# EAGLE design LogicPCB (EAGLE 9.4.2)
Assembly variants: basic, pinout, FIX
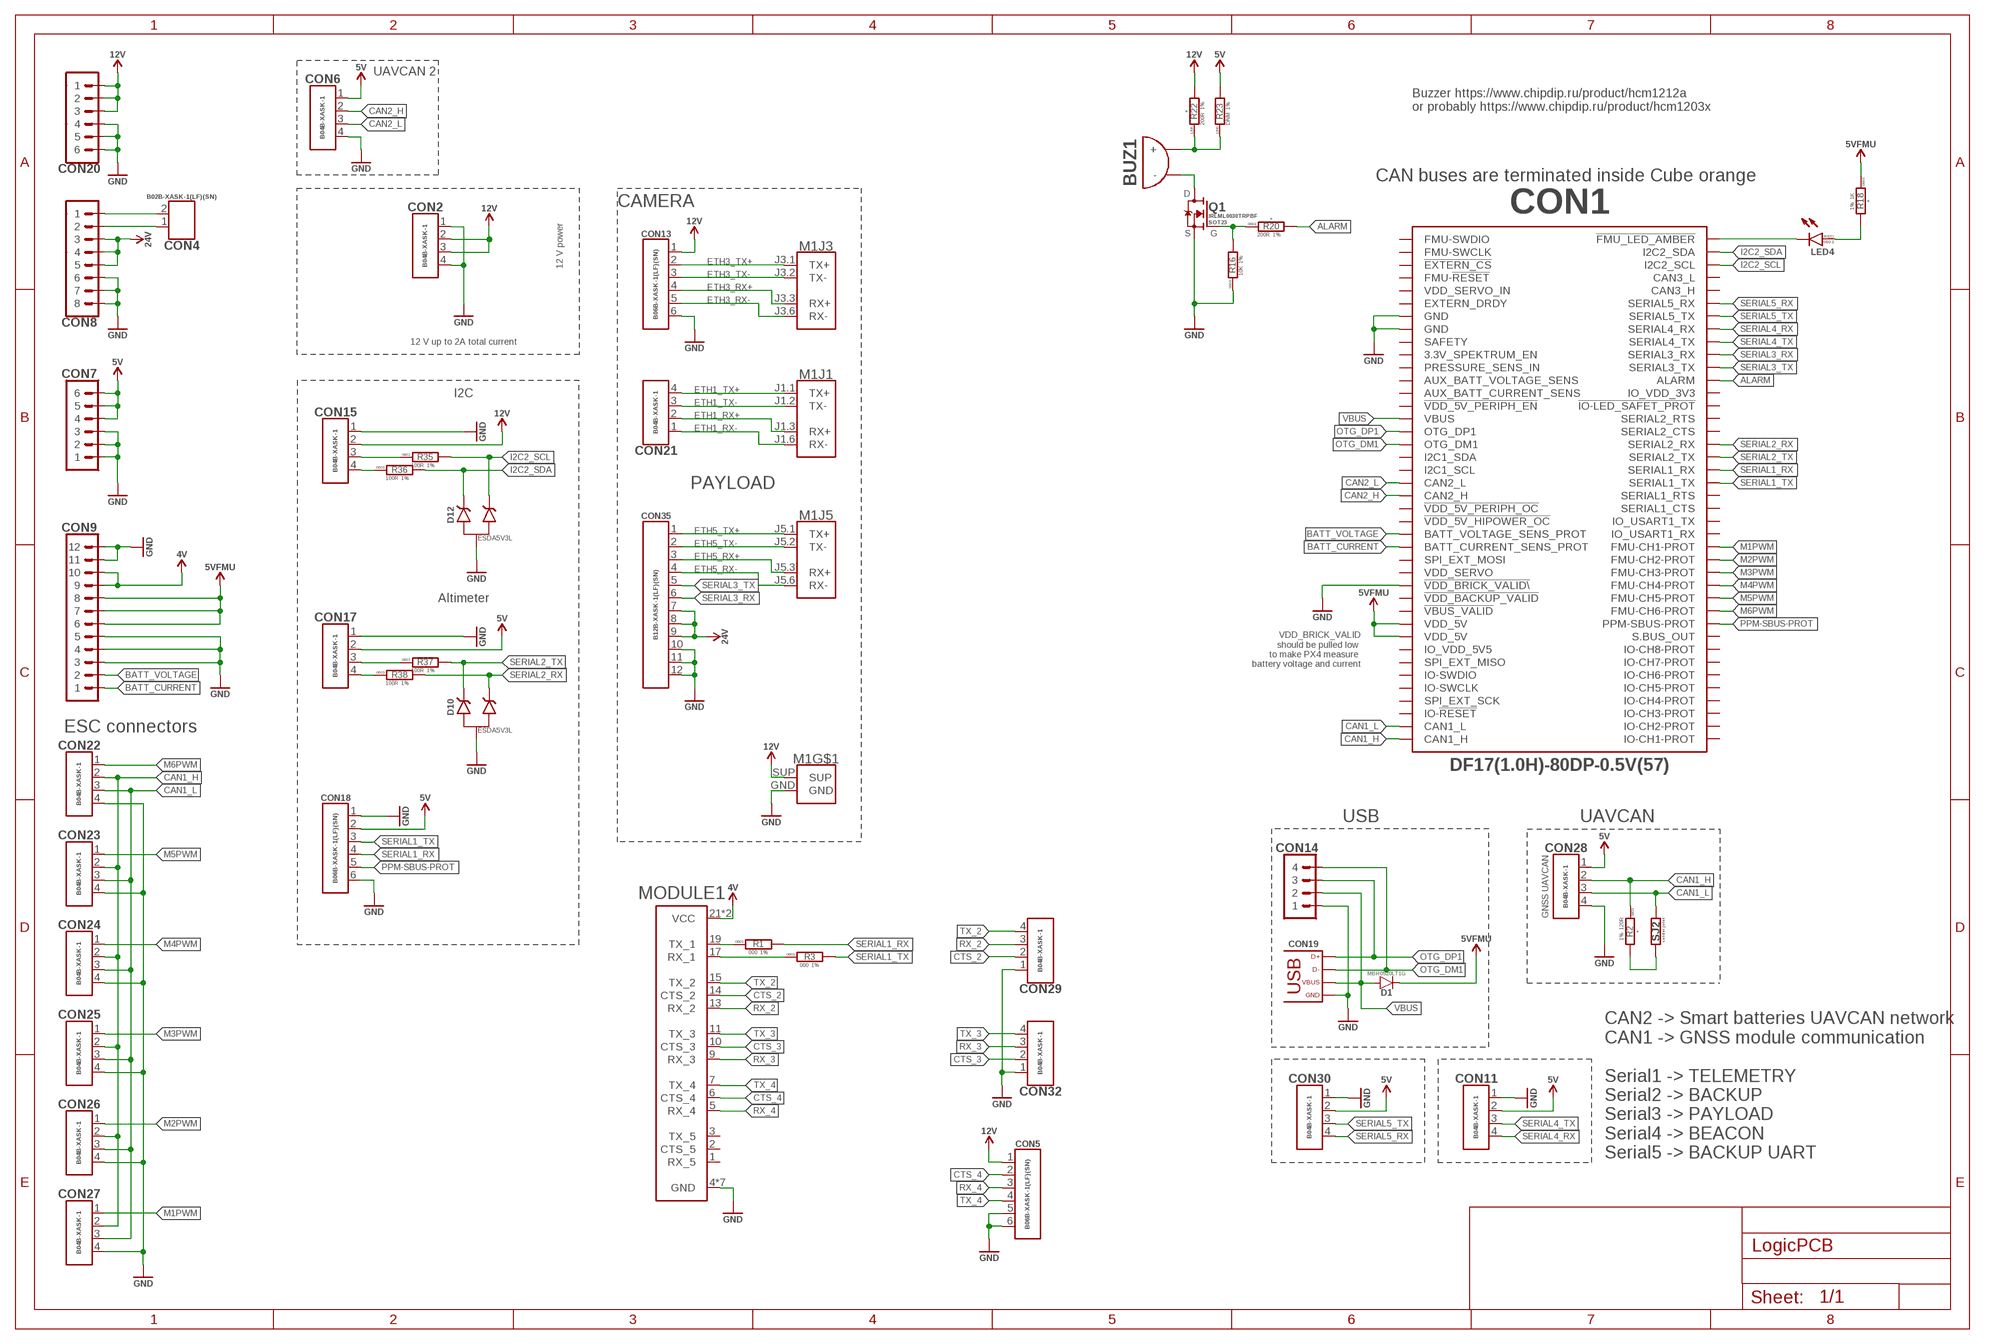
[diagram p0: schematic, sheet 1]

## Parts
BUZ1  BUZZER-ЕР-12MM  [BUZZER_12MM]  (not fitted in variant pinout)
CON1  CUBE_ORANGE_  [CUBE_ORANGE]
CON2  CON-4P-JST-XA  [B04B-XASK-1]
CON4  CON-2P-JST-XA  [B02B-XASK-1]
CON5  CON-6P-JST-XA  [B06B-XASK-1]
CON6  CON-4P-JST-XA  [B04B-XASK-1]
CON7  PINHEAD_1X06-2.54  [1X06-PTH-2.54]
CON8  PINHEAD_1X08-2.54  [1X08-PTH-2.54]
CON9  PINHEAD_1X12-2.54  [1X12-PTH-2.54]
CON11  CON-4P-JST-XA  [B04B-XASK-1]
CON13  CON-6P-JST-XA  [B06B-XASK-1]
CON14  PINHEAD_1X04-2.54  [1X04-PTH-2.54]  (not fitted in variant basic)  (not fitted in variant pinout)
CON15  CON-4P-JST-XA  [B04B-XASK-1]
CON17  CON-4P-JST-XA  [B04B-XASK-1]
CON18  CON-6P-JST-XA  [B06B-XASK-1]
CON19  USB-TYPE-C-VERT-PROD  [2047110001-PROD]
CON20  PINHEAD_1X06-2.54  [1X06-PTH-2.54]
CON21  CON-4P-JST-XA  [B04B-XASK-1]
CON22  CON-4P-JST-XA  [B04B-XASK-1]
CON23  CON-4P-JST-XA  [B04B-XASK-1]
CON24  CON-4P-JST-XA  [B04B-XASK-1]
CON25  CON-4P-JST-XA  [B04B-XASK-1]
CON26  CON-4P-JST-XA  [B04B-XASK-1]
CON27  CON-4P-JST-XA  [B04B-XASK-1]
CON28  CON-4P-JST-XA  [B04B-XASK-1]
CON29  CON-4P-JST-XA  [B04B-XASK-1]
CON30  CON-4P-JST-XA  [B04B-XASK-1]
CON32  CON-4P-JST-XA  [B04B-XASK-1]
CON35  CON-12P-JST-XA  [B12B-XASK-1]
D1  MBR0520L-SOD123  [SOD123]  (not fitted in variant pinout)
D10  ESDA5V3L  [SOT23B-3]
D12  ESDA5V3L  [SOT23B-3]
LED4  LED-0603  [LED0603]  (not fitted in variant pinout)
M1  05G_ETHERNET_SWITCH  [05G_ETH_SWITCH]
MODULE1  MODEM_CARRIER  [MODEM_CARRIER]
Q1  IRLML0030  [SOT23]  (not fitted in variant pinout)
R1  000  R-1%-0603  [R0603]
R2  120R  R-1%-0603  [R0603]  (not fitted in variant pinout)
R3  000  R-1%-0603  [R0603]
R16  10K  R-1%-0603  [R0603]
R18  1K  R-1%-0603  [R0603]  (not fitted in variant pinout)
R20  200R  R-1%-0603  [R0603]  (not fitted in variant pinout)
R22  200R  R-1%-1206  [R1206]  (not fitted in variant pinout)
R23  DNM  R-1%-1206  [R1206]  (not fitted in variant basic)  (not fitted in variant pinout)
R35  100R  R-1%-0603  [R0603]
R36  100R  R-1%-0603  [R0603]
R37  100R  R-1%-0603  [R0603]
R38  100R  R-1%-0603  [R0603]
SJ2  SOLDER_JOINT-SJ1  [RES_0]  (not fitted in variant basic)  (not fitted in variant pinout)

## Nets
5VFMU: CON1.61(VDD_5V) CON1.63(VDD_5V) CON9.6 CON9.7 CON9.8 D1.C R18.1
!FMU_LED_AMBER: CON1.2(!FMU_LED_AMBER) LED4.C
ALARM: CON1.24(ALARM) R20.2
BATT_CURRENT: CON1.49(BATT_CURRENT_SENS_PROT) CON9.1
BATT_VOLTAGE: CON1.47(BATT_VOLTAGE_SENS_PROT) CON9.2
CAN1_H: CON1.79(CAN1_H) CON22.2 CON23.2 CON24.2 CON25.2 CON26.2 CON27.2 CON28.2 R2.1
CAN1_L: CON1.77(CAN1_L) CON22.3 CON23.3 CON24.3 CON25.3 CON26.3 CON27.3 CON28.3 SJ2.2
CAN2_H: CON1.41(CAN2_H) CON6.2
CAN2_L: CON1.39(CAN2_L) CON6.3
CTS_2: CON29.2 MODULE1.14(CTS_2)
CTS_3: CON32.2 MODULE1.10(CTS_3)
CTS_4: CON5.2 MODULE1.6(CTS_4)
ETH1_RX+: CON21.2 M1.J1.3(J1:RX+)
ETH1_RX-: CON21.1 M1.J1.6(J1:RX-)
ETH1_TX+: CON21.4 M1.J1.1(J1:TX+)
ETH1_TX-: CON21.3 M1.J1.2(J1:TX-)
ETH3_RX+: CON13.4 M1.J3.3(J3:RX+)
ETH3_RX-: CON13.5 M1.J3.6(J3:RX-)
ETH3_TX+: CON13.2 M1.J3.1(J3:TX+)
ETH3_TX-: CON13.3 M1.J3.2(J3:TX-)
ETH5_RX+: CON35.3 M1.J5.3(J5:RX+)
ETH5_RX-: CON35.4 M1.J5.6(J5:RX-)
ETH5_TX+: CON35.1 M1.J5.1(J5:TX+)
ETH5_TX-: CON35.2 M1.J5.2(J5:TX-)
GND: CON1.13(GND) CON1.15(GND) CON1.55(!VDD_BRICK_VALID\) CON2.1 CON2.4 CON5.5 CON5.6 CON6.4 CON7.1 CON7.2 CON7.3 CON8.6 CON8.7 CON8.8 CON9.3 CON9.4 CON9.5 CON9.11 CON9.12 CON11.1 CON13.6 CON14.1 CON15.1 CON17.1 CON18.1 CON18.6 CON19.A1(GND) CON19.A12(GND) CON19.B1(GND) CON19.B12(GND) CON19.G1(GND) CON19.G2(GND) CON19.G4(GND) CON19.G5(GND) CON19.G7(GND) CON19.G8(GND) CON19.G9(GND) CON19.G10(GND) CON19.P$1(GND) CON19.P$2(GND) CON20.4 CON20.5 CON20.6 CON22.4 CON23.4 CON24.4 CON25.4 CON26.4 CON27.4 CON28.4 CON29.1 CON30.1 CON32.1 CON35.10 CON35.11 CON35.12 D10.3(A) D12.3(A) M1.GND MODULE1.4(GND) MODULE1.8(GND) MODULE1.12(GND) MODULE1.16(GND) MODULE1.20(GND) MODULE1.22(GND) MODULE1.24(GND) Q1.2(S) R16.1
I2C2_SCL: CON1.6(I2C2_SCL) D12.2(C1) R35.2
I2C2_SDA: CON1.4(I2C2_SDA) D12.1(C) R36.2
M1PWM: CON1.50(FMU-CH1-PROT) CON27.1
M2PWM: CON1.52(FMU-CH2-PROT) CON26.1
M3PWM: CON1.54(FMU-CH3-PROT) CON25.1
M4PWM: CON1.56(FMU-CH4-PROT) CON24.1
M5PWM: CON1.58(FMU-CH5-PROT) CON23.1
M6PWM: CON1.60(FMU-CH6-PROT) CON22.1
N$1: LED4.A R18.2
N$2: CON4.2 CON8.1
N$3: BUZ1.2(-) Q1.3(D)
N$4: MODULE1.19(TX_1) R1.1
N$5: Q1.1(G) R16.2 R20.1
N$6: MODULE1.17(RX_1) R3.1
N$7: CON4.1 CON8.2
N$8: R2.2 SJ2.1
N$13: BUZ1.1(+) R22.P$1 R23.P$1
N$20: CON15.3 R35.1
N$21: CON15.4 R36.1
N$22: CON17.3 R37.1
N$23: CON17.4 R38.1
OTG_DM1: CON1.33(OTG_DM1) CON14.4 CON19.A7(D-) CON19.B7(D-)
OTG_DP1: CON1.31(OTG_DP1) CON14.3 CON19.A6(D+) CON19.B6(D+)
PPM-SBUS-PROT: CON1.62(PPM-SBUS-PROT) CON18.5
RX_2: CON29.3 MODULE1.13(RX_2)
RX_3: CON32.3 MODULE1.9(RX_3)
RX_4: CON5.3 MODULE1.5(RX_4)
SERIAL1_RX: CON1.38(SERIAL1_RX) CON18.4 R1.2
SERIAL1_TX: CON1.40(SERIAL1_TX) CON18.3 R3.2
SERIAL2_RX: CON1.34(SERIAL2_RX) D10.2(C1) R38.2
SERIAL2_TX: CON1.36(SERIAL2_TX) D10.1(C) R37.2
SERIAL3_RX: CON1.20(SERIAL3_RX) CON35.6
SERIAL3_TX: CON1.22(SERIAL3_TX) CON35.5
SERIAL4_RX: CON1.16(SERIAL4_RX) CON11.4
SERIAL4_TX: CON1.18(SERIAL4_TX) CON11.3
SERIAL5_RX: CON1.12(SERIAL5_RX) CON30.4
SERIAL5_TX: CON1.14(SERIAL5_TX) CON30.3
TX_2: CON29.4 MODULE1.15(TX_2)
TX_3: CON32.4 MODULE1.11(TX_3)
TX_4: CON5.4 MODULE1.7(TX_4)
VBUS: CON1.29(VBUS) CON14.2 CON19.A4(VBUS) CON19.B4(VBUS) D1.A
VDD_4V: CON9.9 CON9.10 MODULE1.21(VCC) MODULE1.23(VCC) ; supply symbol labelled 4V
VDD_5V: CON6.1 CON7.4 CON7.5 CON7.6 CON11.2 CON17.2 CON18.2 CON28.1 CON30.2 R23.P$2 ; supply symbol labelled 5V
VDD_12V: CON2.2 CON2.3 CON5.1 CON13.1 CON15.2 CON20.1 CON20.2 CON20.3 M1.SUP R22.P$2 ; supply symbol labelled 12V
VDD_24V: CON8.3 CON8.4 CON8.5 CON35.7 CON35.8 CON35.9 ; supply symbol labelled 24V
Unconnected: CON1.1(FMU-SWDIO) CON1.3(FMU-SWCLK) CON1.5(!EXTERN_CS) CON1.7(FMU-!RESET) CON1.8(CAN3_L) CON1.9(VDD_SERVO_IN) CON1.10(CAN3_H) CON1.11(EXTERN_DRDY) CON1.17(SAFETY) CON1.19(3.3V_SPEKTRUM_EN) CON1.21(PRESSURE_SENS_IN) CON1.23(AUX_BATT_VOLTAGE_SENS) CON1.25(AUX_BATT_CURRENT_SENS) CON1.26(IO_VDD_3V3) CON1.27(!VDD_5V_PERIPH_EN) CON1.28(!IO-LED_SAFET_PROT) CON1.30(SERIAL2_RTS) CON1.32(SERIAL2_CTS) CON1.35(I2C1_SDA) CON1.37(I2C1_SCL) CON1.42(SERIAL1_RTS) CON1.43(!VDD_5V_PERIPH_OC) CON1.44(SERIAL1_CTS) CON1.45(!VDD_5V_HIPOWER_OC) CON1.46(IO_USART1_TX) CON1.48(IO_USART1_RX) CON1.51(SPI_EXT_MOSI) CON1.53(VDD_SERVO) CON1.57(!VDD_BACKUP_VALID) CON1.59(!VBUS_VALID) CON1.64(S.BUS_OUT) CON1.65(IO_VDD_5V5) CON1.66(IO-CH8-PROT) CON1.67(SPI_EXT_MISO) CON1.68(IO-CH7-PROT) CON1.69(IO-SWDIO) CON1.70(IO-CH6-PROT) CON1.71(IO-SWCLK) CON1.72(IO-CH5-PROT) CON1.73(SPI_EXT_SCK) CON1.74(IO-CH4-PROT) CON1.75(IO-!RESET) CON1.76(IO-CH3-PROT) CON1.78(IO-CH2-PROT) CON1.80(IO-CH1-PROT) M1.J2.1(J2:TX+) M1.J2.2(J2:TX-) M1.J2.3(J2:RX+) M1.J2.6(J2:RX-) M1.J4.1(J4:TX+) M1.J4.2(J4:TX-) M1.J4.3(J4:RX+) M1.J4.6(J4:RX-) MODULE1.1(RX_5) MODULE1.2(CTS_5) MODULE1.3(TX_5)

## Notes on the sheet
- UAVCAN 2
- Buzzer https://www.chipdip.ru/product/hcm1212a
  or probably https://www.chipdip.ru/product/hcm1203x
- CAN buses are terminated inside Cube orange
- CAMERA
- 12 V power
- 12 V up to 2A total current
- I2C
- PAYLOAD
- Altimeter
- VDD_BRICK_VALID
  should be pulled low 
  to make PX4 measure 
  battery voltage and current
- ESC connectors
- USB | UAVCAN
- GNSS UAVCAN
- CAN2 -> Smart batteries UAVCAN network
  CAN1 -> GNSS module communication
  
  Serial1 -> TELEMETRY
  Serial2 -> BACKUP 
  Serial3 -> PAYLOAD
  Serial4 -> BEACON
  Serial5 -> BACKUP UART

## Library data of the parts
BUZ1 = misc:BUZZER; MANF: JL World; MANF#: HCM1212A
CON1 = misc:CUBE_ORANGE; MANF: HIROSE; MANF#: DF17(1.0H)-80DP-0.5V(57)
CON2 CON6 CON11 CON15 CON17 CON21-CON30 CON32 = Connectors:CON-4P; LCSC#: C264994; MANF: JST Sales America; MANF#: B04B-XASK-1
CON4 = Connectors:CON-2P: Connector 2 position; LCSC#: C263753; MANF: JST Sales America; MANF#: B02B-XASK-1(LF)(SN)
CON5 CON13 CON18 = Connectors:CON-6P: Connector Header 6 position; LCSC#: C264995; MANF: JST Sales America; MANF#: B06B-XASK-1(LF)(SN)
CON7 CON20 = pinhead:PINHEAD_1X06: pinheader 6P
CON8 = pinhead:PINHEAD_1X08: pinheader 8P
CON9 = pinhead:PINHEAD_1X12
CON14 = pinhead:PINHEAD_1X04
CON19 = Connectors:USB: Connector Receptacle USB 2; LCSC#: C381139; MANF: Molex; MANF#: 2047110001
CON35 = Connectors:CON-12P; LCSC#: C160310; MANF: JST Sales America; MANF#: B12B-XASK-1(LF)(SN)
D1 = Diodes:MBR0520L: DIODE SCHOTTKY 20V 500MA SOD123; DIGIKEY#: MBR0520LT1GOSTR-ND; LCSC#: C23848; MANF: ON Semiconductor; MANF#: MBR0520LT1G
D10 D12 = TVS_diodes:ESDA5V3L: TVS DIODE 5.25VWM SOT23; DIGIKEY#: 497-2930-2-ND; LCSC#: C87911; MANF: STMicroelectronics; MANF#: ESDA5V3L
LED4 = rc:LED: Light emitting diode; COLOR: RED; LCSC#: C2286; MANF: Hubei KENTO Elec; MANF#: KT-0603R; PACKAGE: 0603
M1 = ali_modules:05G_ETHERNET_SWITCH
MODULE1 = Pegas_misc:MODEM_CARRIER
Q1 = mosfet:IRLML0030: MOSFET N-CH 30V 5.3A SOT-23-3; DIGIKEY#: IRLML0030TRPBFTR-ND; LCSC#: C3647050; MANF: Infineon Technologies; MANF#: IRLML0030TRPBF; PACKAGE: SOT23
R1 R3 R16 R35-R38 = rc:R; PACKAGE: 0603; TOLERANCE: 1%
R2 = rc:R; ALLOCATED: +; LCSC#: C22787; MANF: UNI-ROYAL(Uniroyal Elec); MANF#: 0603WAF1200T5E; PACKAGE: 0603; TOLERANCE: 1%
R18 R20 = rc:R; ALLOCATED: +; LCSC#: C21190; MANF: UNI-ROYAL(Uniroyal Elec); MANF#: 0603WAF1001T5E; PACKAGE: 0603; TOLERANCE: 1%
R22 = rc:R; ALLOCATED: +; LCSC#: C25361; MANF: UNI-ROYAL; MANF#: 1206W4J0201T5E; PACKAGE: 1206; TOLERANCE: 1%
R23 = rc:R; PACKAGE: 1206; TOLERANCE: 1%
SJ2 = misc:SOLDER_JOINT

## Net classes
1 HV: clearance 0.3 mm to class 0, clearance 0.3 mm

## Board
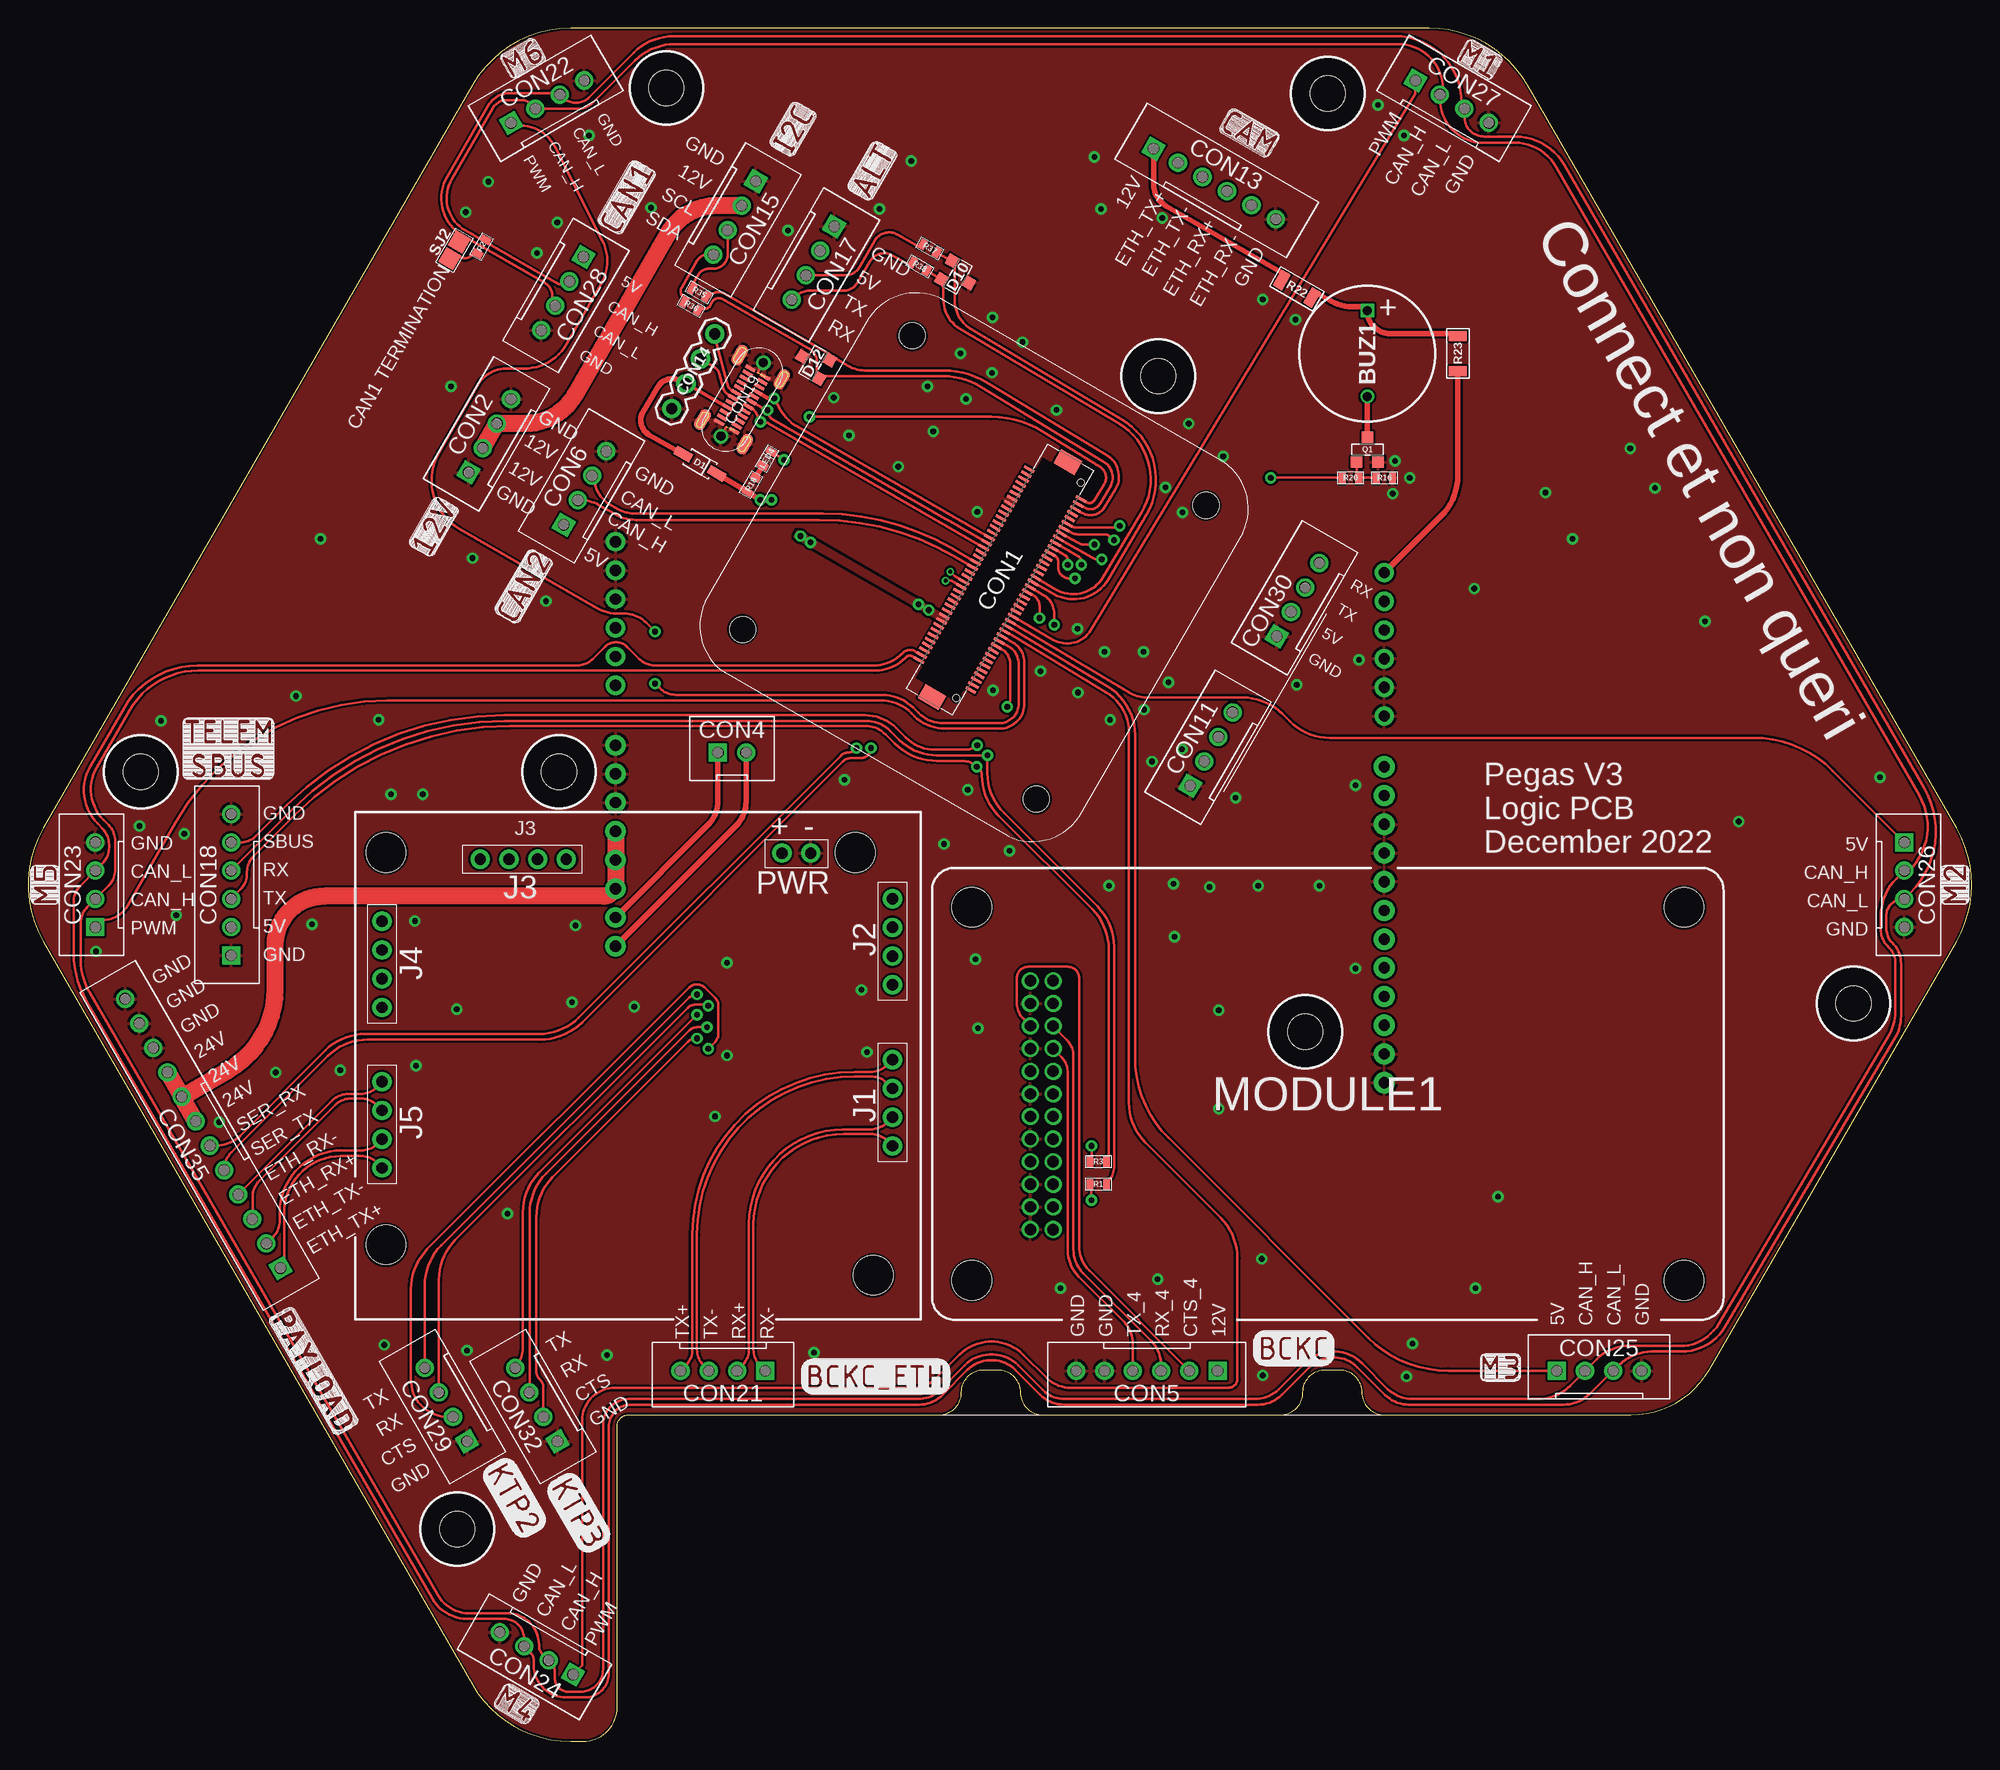
[diagram p1: board, top side]
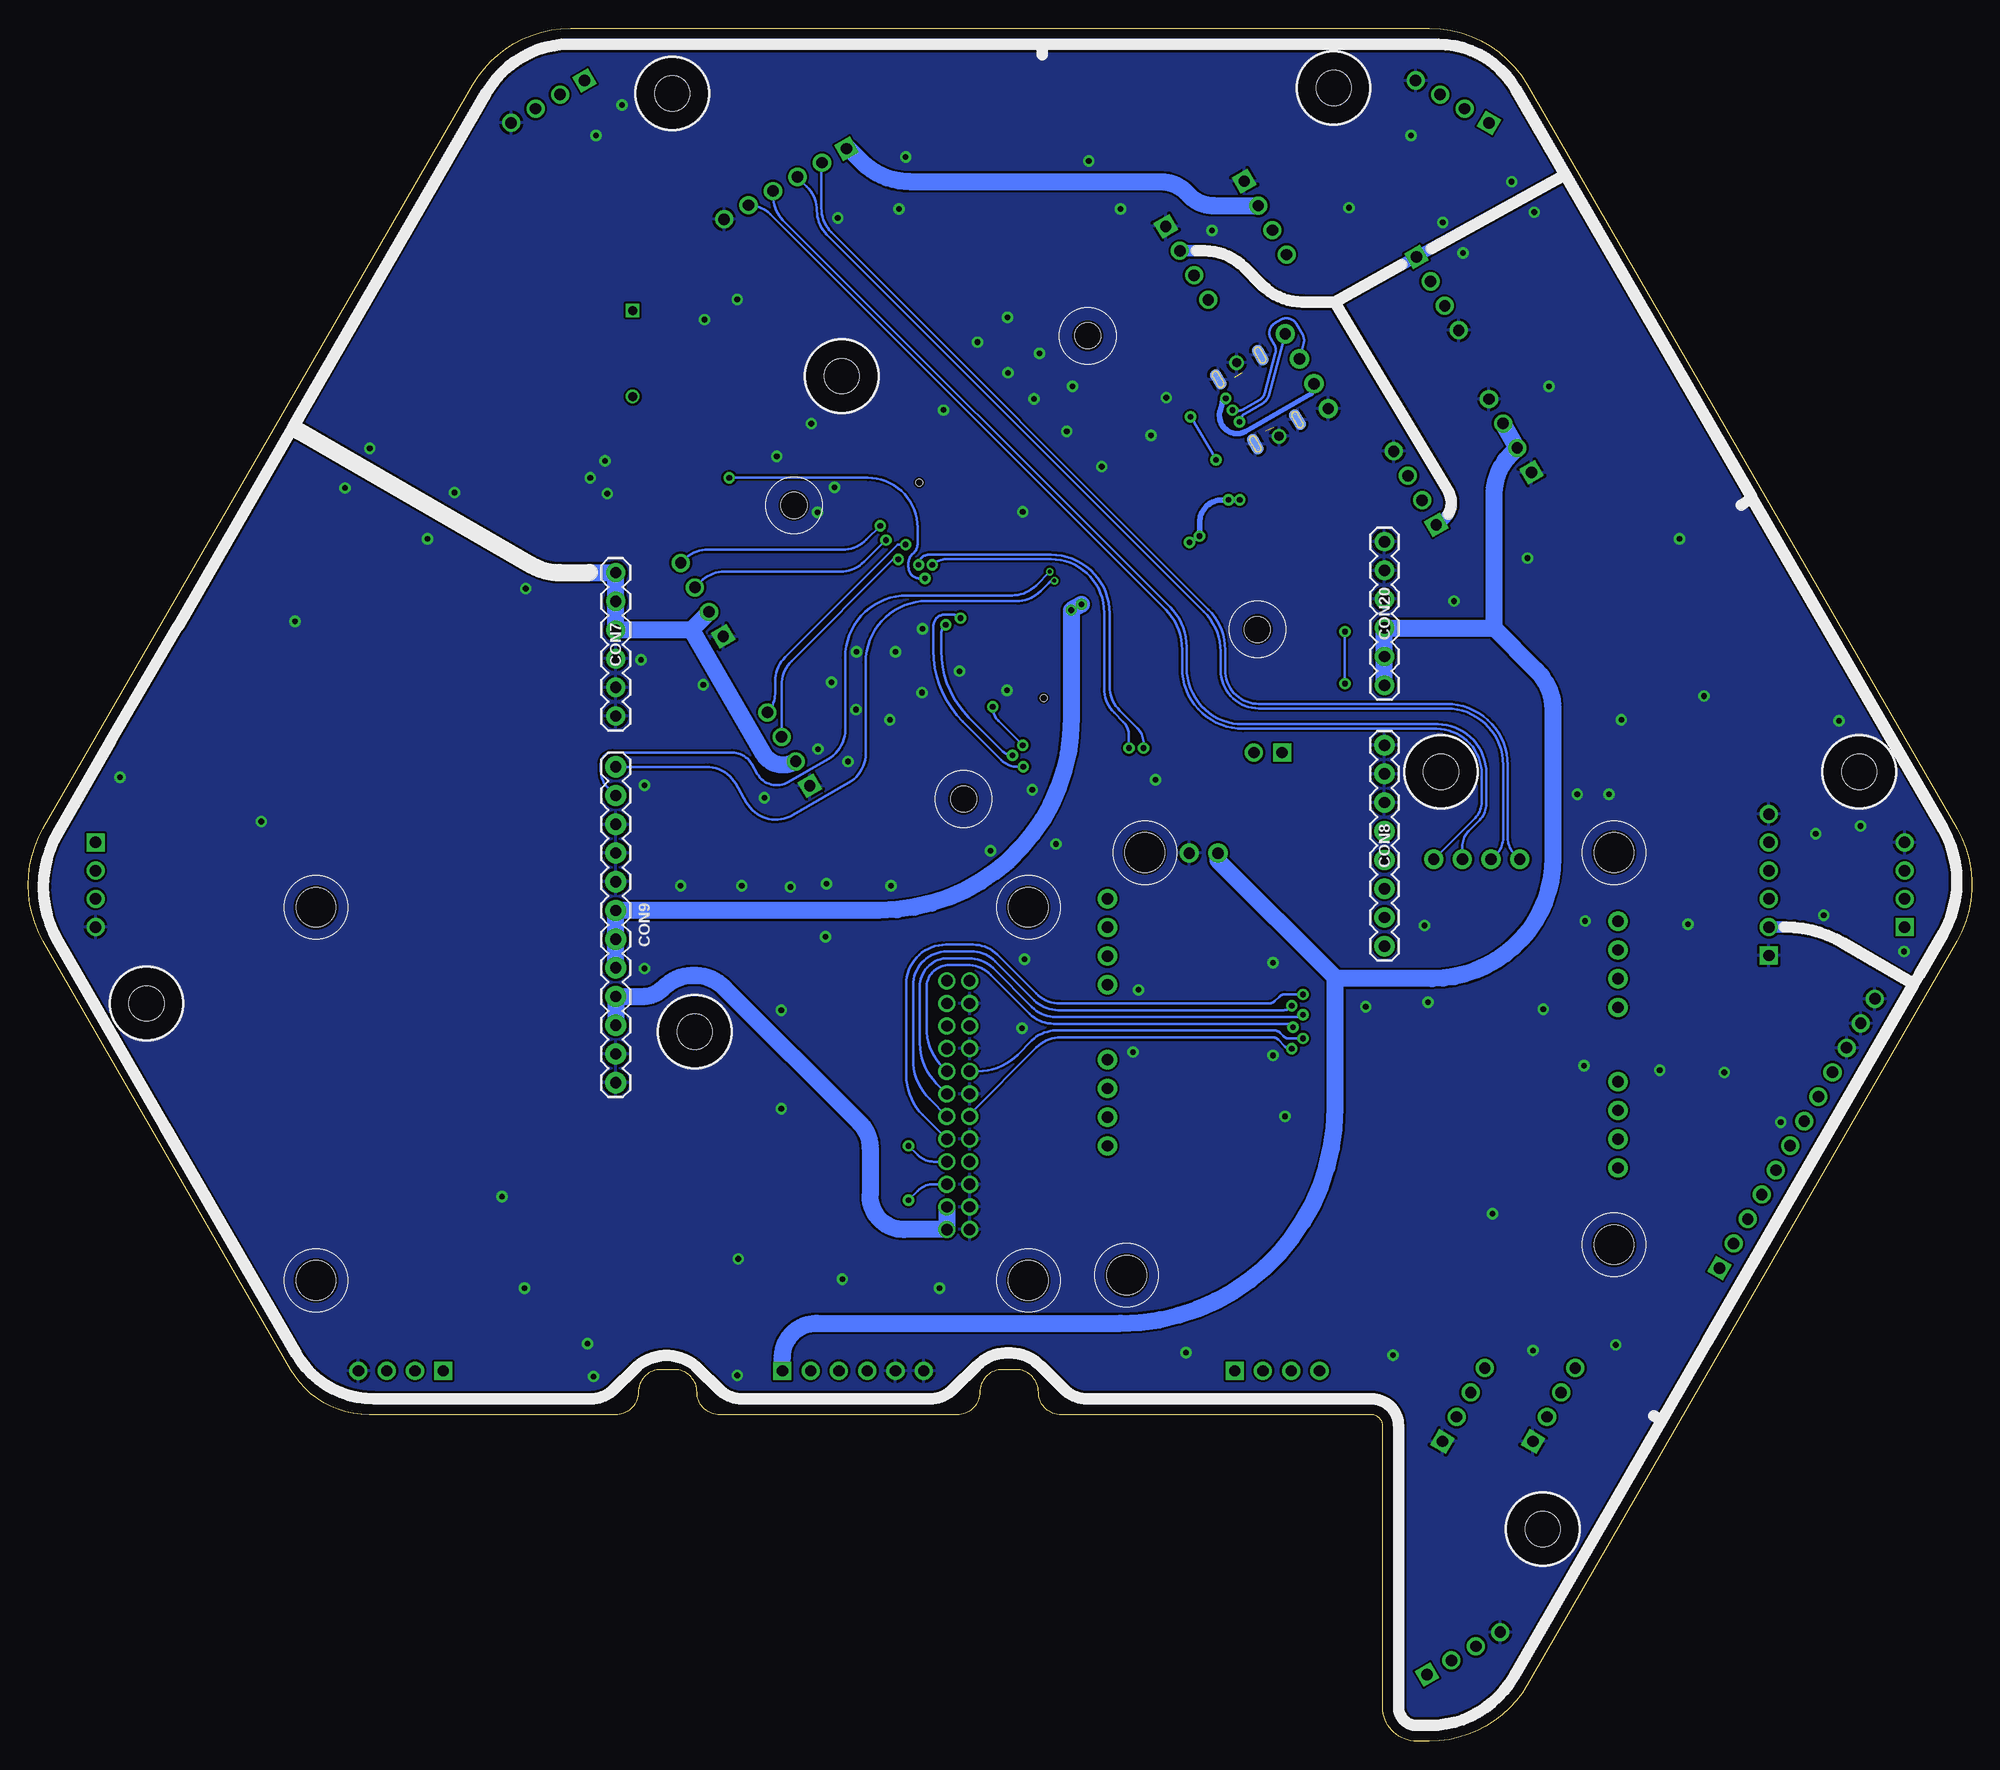
[diagram p2: board, bottom side, seen from below]

Size 171.89 x 151.55 mm. Coordinates in mm from the lower left corner, seen from the top.
Outline: 47.97,0 49.09,0 arc90 52.09,3 52.09,27.88 arc-90 53.09,28.88 80.54,28.88 arc90 82.54,30.88 arc-90 84.54,32.88 85.74,32.88 arc-90 87.74,30.88 arc90 89.74,28.88 110.74,28.88 arc90 112.74,30.88 arc-90 114.74,32.88 115.94,32.88 arc-90 117.94,30.88 arc90 119.94,28.88 141.75,28.88 arc60 148.68,32.88 170.55,70.78 arc60 170.55,80.78 132.58,146.55 arc60 123.92,151.55 47.97,151.55 arc60 39.3,146.55 1.33,80.78 arc60 1.33,70.78 39.3,5 arc60 47.97,0
Copper layers (1*16): Top 0.035mm / dielectric 1.5mm / Bottom 0.035mm
Design rules "JLCPCB 2 layer *": minimum track width 6mil, minimum drill 0.3mm, track to track 0.2mm, track to pad 0.2mm, pad to pad 0.2mm, via to via 0.2mm, smd to smd 0.1mm, copper to edge 0.2mm, drill to drill 6mil, minimum pad ring 0.15mm, minimum via ring 0.15mm, stop-mask expansion 0.05mm, vias tented up to drill 0.5mm, thermal gap 10mil
Holes 3.1 mm at 9.94,85.78 37.94,18.78 114.94,145.78 161.44,65.28 56.44,146.28 99.94,120.78 46.94,85.78 112.94,62.78
Holes 3.5 mm at 31.64,43.93 73.14,78.63 31.64,78.63 83.44,73.78 146.44,73.78 146.44,40.78 83.44,40.78 74.74,41.23
tRestrict: area 6.7,82.5 to 13.2,89; area 34.7,15.5 to 41.2,22; area 111.7,142.5 to 118.2,149; area 158.2,62 to 164.7,68.5; area 53.2,143 to 59.7,149.5; area 96.7,117.5 to 103.2,124; area 43.7,82.5 to 50.2,89; area 109.7,59.5 to 116.2,66
bRestrict: area 6.7,82.5 to 13.2,89; area 34.7,15.5 to 41.2,22; area 111.7,142.5 to 118.2,149; area 158.2,62 to 164.7,68.5; area 53.2,143 to 59.7,149.5; area 96.7,117.5 to 103.2,124; area 43.7,82.5 to 50.2,89; area 109.7,59.5 to 116.2,66

### Footprints (pad centres in the part's own frame; a part is rotated, then mirrored left to right if it is on the bottom)
BUZZER_12MM = drill 0.8 pad 1.2 square: 1 -3.8,0 | drill 0.8 pad 1.2: 2 3.8,0
CUBE_ORANGE = smd 0.25 x 1: 1 9.75,2.65; 2 9.75,-2.65; 3 9.25,2.65; 4 9.25,-2.65; 5 8.75,2.65; 6 8.75,-2.65; 7 8.25,2.65; 8 8.25,-2.65; 9 7.75,2.65; 10 7.75,-2.65; 11 7.25,2.65; 12 7.25,-2.65; 13 6.75,2.65; 14 6.75,-2.65; 15 6.25,2.65; 16 6.25,-2.65; 17 5.75,2.65; 18 5.75,-2.65; 19 5.25,2.65; 20 5.25,-2.65; 21 4.75,2.65; 22 4.75,-2.65; 23 4.25,2.65; 24 4.25,-2.65; 25 3.75,2.65; 26 3.75,-2.65; 27 3.25,2.65; 28 3.25,-2.65; 29 2.75,2.65; 30 2.75,-2.65; 31 2.25,2.65; 32 2.25,-2.65; 33 1.75,2.65; 34 1.75,-2.65; 35 1.25,2.65; 36 1.25,-2.65; 37 0.75,2.65; 38 0.75,-2.65; 39 0.25,2.65; 40 0.25,-2.65; 41 -0.25,2.65; 42 -0.25,-2.65; 43 -0.75,2.65; 44 -0.75,-2.65; 45 -1.25,2.65; 46 -1.25,-2.65; 47 -1.75,2.65; 48 -1.75,-2.65; 49 -2.25,2.65; 50 -2.25,-2.65; 51 -2.75,2.65; 52 -2.75,-2.65; 53 -3.25,2.65; 54 -3.25,-2.65; 55 -3.75,2.65; 56 -3.75,-2.65; 57 -4.25,2.65; 58 -4.25,-2.65; 59 -4.75,2.65; 60 -4.75,-2.65; 61 -5.25,2.65; 62 -5.25,-2.65; 63 -5.75,2.65; 64 -5.75,-2.65; 65 -6.25,2.65; 66 -6.25,-2.65; 67 -6.75,2.65; 68 -6.75,-2.65; 69 -7.25,2.65; 70 -7.25,-2.65; 71 -7.75,2.65; 72 -7.75,-2.65; 73 -8.25,2.65; 74 -8.25,-2.65; 75 -8.75,2.65; 76 -8.75,-2.65; 77 -9.25,2.65; 78 -9.25,-2.65; 79 -9.75,2.65; 80 -9.75,-2.65 | smd 1.4 x 2.1: P1 -12,0; P2 12,0 | hole 0.6: -11,-1.9; 11,-1.9 | hole 2.3: -15.2,17.5; 14.8,17.5; 14.8,-12.5; -15.2,-12.5
B04B-XASK-1 = drill 1 pad 1.6 square: 1 -3.75,0 | drill 1 pad 1.6: 2 -1.25,0; 3 1.25,0; 4 3.75,0
B02B-XASK-1 = drill 1 pad 1.6 square: 1 -1.25,0 | drill 1 pad 1.6: 2 1.25,0
B06B-XASK-1 = drill 1 pad 1.6 square: 1 -6.25,0 | drill 1 pad 1.6: 2 -3.75,0; 3 -1.25,0; 4 1.25,0; 5 3.75,0; 6 6.25,0
1X06-PTH-2.54 = drill 1 pad 1.7: 1 -6.35,0; 2 -3.81,0; 3 -1.27,0; 4 1.27,0; 5 3.81,0; 6 6.35,0
1X08-PTH-2.54 = drill 1 pad 1.8: 1 -8.89,0; 2 -6.35,0; 3 -3.81,0; 4 -1.27,0; 5 1.27,0; 6 3.81,0; 7 6.35,0; 8 8.89,0
1X12-PTH-2.54 = drill 1 pad 1.88: 1 -13.97,0; 2 -11.43,0; 3 -8.89,0; 4 -6.35,0; 5 -3.81,0; 6 -1.27,0; 7 1.27,0; 8 3.81,0; 9 6.35,0; 10 8.89,0; 11 11.43,0; 12 13.97,0
1X04-PTH-2.54 = drill 1 pad 1.7: 1 -3.81,0; 2 -1.27,0; 3 1.27,0; 4 3.81,0
2047110001-PROD = smd 0.3 x 0.95: A1 -2.75,0.755; A2 -2.25,0.755; A3 -1.75,0.755; A4 -1.25,0.755; A5 -0.75,0.755; A6 -0.25,0.755; A7 0.25,0.755; A8 0.75,0.755; A9 1.25,0.755; A10 1.75,0.755; A11 2.25,0.755; A12 2.75,0.755; B1 2.75,-0.755; B2 2.25,-0.755; B3 1.75,-0.755; B4 1.25,-0.755; B5 0.75,-0.755; B6 0.25,-0.755; B7 -0.25,-0.755; B8 -0.75,-0.755; B9 -1.25,-0.755; B10 -1.75,-0.755; B11 -2.25,-0.755; B12 -2.75,-0.755 | smd 1.9 x 1: G1 -3.3,2.15; G4 3.3,2.15; G7 -3.3,-2.15; G9 3.3,-2.15 | smd 1.9 x 1 bottom: G2 -3.3,2.15; G5 3.3,2.15; G8 -3.3,-2.15; G10 3.3,-2.15 | drill 0.8 pad 1.3: P$1 -3.75,0; P$2 3.75,0
B12B-XASK-1 = drill 1 pad 1.6 square: 1 -13.75,0 | drill 1 pad 1.6: 2 -11.25,0; 3 -8.75,0; 4 -6.25,0; 5 -3.75,0; 6 -1.25,0; 7 1.25,0; 8 3.75,0; 9 6.25,0; 10 8.75,0; 11 11.25,0; 12 13.75,0
SOD123 = smd 1.6 x 0.8: A -1.7,0; C 1.7,0
SOT23B-3 = smd 1 x 1: 1 -0.95,-1.1; 2 0.95,-1.1; 3 0,1.1
LED0603 = smd 0.6 x 0.9: A 0.725,0; C -0.725,0
05G_ETH_SWITCH = drill 1 pad 1.7: GND -15.27,-18.8; J1.1 -22.5,-0.52; J1.2 -22.5,2.02; J1.3 -22.5,4.56; J1.6 -22.5,7.1; J2.1 -22.5,-14.77; J2.2 -22.5,-12.23; J2.3 -22.5,-9.69; J2.6 -22.5,-7.15; J3.1 13.97,-18.25; J3.2 11.43,-18.25; J3.3 8.89,-18.25; J3.6 6.35,-18.25; J4.1 22.65,-5.15; J4.2 22.65,-7.69; J4.3 22.65,-10.23; J4.6 22.65,-12.77; J5.1 22.65,9.05; J5.2 22.65,6.51; J5.3 22.65,3.97; J5.6 22.65,1.43; SUP -12.73,-18.8
MODEM_CARRIER = drill 1: 1 -24.3,10; 2 -26.3,10; 3 -24.3,8; 4 -26.3,8; 5 -24.3,6; 6 -26.3,6; 7 -24.3,4; 8 -26.3,4; 9 -24.3,2; 10 -26.3,2; 11 -24.3,0; 12 -26.3,0; 13 -24.3,-2; 14 -26.3,-2; 15 -24.3,-4; 16 -26.3,-4; 17 -24.3,-6; 18 -26.3,-6; 19 -24.3,-8; 20 -26.3,-8; 21 -24.3,-10; 22 -26.3,-10; 23 -24.3,-12; 24 -26.3,-12
SOT23 = smd 1 x 1: 1 1.1,-0.95; 2 1.1,0.95; 3 -1.1,0
R0603 = smd 0.6 x 0.9: 1 -0.725,0; 2 0.725,0
R1206 = smd 0.9 x 1.6: P$1 -1.55,0; P$2 1.55,0
RES_0 = smd 1.5 x 1.5: 1 -0.85,0; 2 0.85,0

### Placement (x,y rotation side)
BUZ1  118.44,122.78 270 top
CON1  85.94,102.78 60 top
CON2  40.83,115.5 60 top
CON4  62.24,87.48 0 top
CON5  98.94,32.78 180 top
CON6  49.24,110.88 60 top
CON7  119.94,97.05 90 bottom
CON8  51.94,79.24 90 bottom
CON9  119.94,72.24 270 bottom
CON11  104.64,87.78 60 top
CON13  104.94,137.78 330 top
CON14  58.82,121.2 60 top
CON15  62.48,134.78 240 top
CON17  69.41,130.78 240 top
CON18  17.94,75.78 90 top
CON19  63.15,118.7 60 top
CON20  51.94,99.78 90 bottom
CON21  61.44,32.78 180 top
CON22  45.94,145.06 30 top
CON23  5.94,75.78 90 top
CON24  44.94,7.78 150 top
CON25  138.94,32.78 0 top
CON26  165.94,75.78 270 top
CON27  125.94,145.06 330 top
CON28  47.24,128.08 240 top
CON29  36.94,29.78 120 top
CON30  112.31,101 60 top
CON32  44.94,29.78 120 top
CON35  15.44,53.78 120 top
D1  59.41,113.02 330 top
D10  82.22,129.59 240 top
D12  69.44,121.95 60 top
LED4  65.34,113.48 240 top
M1  53.94,59.78 180 top
MODULE1  114.94,57.28 0 top
Q1  118.44,114.28 270 top
R1  94.64,49.28 0 top
R2  40.09,132.23 240 top
R3  94.64,51.28 0 top
R16  119.94,111.78 180 top
R18  63.94,111.18 60 top
R20  116.94,111.78 180 top
R22  112.21,128.5 150 top
R23  126.44,122.78 270 top
R35  59.34,128.18 330 top
R36  58.64,126.98 330 top
R37  79.74,132.08 330 top
R38  78.84,130.48 330 top
SJ2  37.7,131.91 60 top

### Tracks (layer width: path | path; a pad name or v marks a point on that pad's centre or on a via)
5VFMU  (via drill 0.5 pad 1)
  Top 0.5: D1.C R18.1 v64.74,109.83 v65.74,109.83
  Bottom 0.5: v69.19,106.08 v68.29,106.63 68.29,107.83 arc90 66.29,109.83 v64.74,109.83
  Bottom 1.5: v78.74,100.58 v79.64,100.08 79.64,90.51 arc90 96.64,73.51 CON9.6 CON9.7 CON9.8
  pour Top (no thermals): 81.1,98.91 67.78,106.6 68.06,107.08 81.38,99.39
!FMU_LED_AMBER  (via drill 0.5 pad 1)
  Top 0.2: v69.09,117.18 85.16,117.18 arc-32 89.74,115.88 94.78,112.78 arc-90 95.16,111.22 94.29,109.78 arc-88 93.63,109.61 CON1.2 | LED4.C v66.84,113.38
  Bottom 0.2: v66.84,113.38 v69.09,117.18
ALARM  (via drill 0.5 pad 1)
  Top 0.2: CON1.24 90.38,105.13 90.85,104.85 arc-59 91.09,104.42 91.09,103.88 arc90 92.09,102.88 v92.59,102.88 | R20.2 v109.89,111.78
  Bottom 0.2: v92.59,102.88 93.04,102.88 arc90 94.04,103.88 94.04,104.26 arc45 93.75,104.97 93.53,105.18 arc-45 93.24,105.89 93.24,107.38 arc-90 97.64,111.78 v109.89,111.78
BATT_CURRENT  (via drill 0.35)
  Top 0.2: CON1.49 81.64,102.68 v81.14,102.68
  Bottom 0.2: v81.14,102.68 arc-45 81.65,102.47 82.36,101.76 arc45 84.48,100.88 92.42,100.88 arc-90 97.82,95.48 97.82,87.4 arc60 99.32,84.8 104.27,81.95 arc90 108.37,83.04 109.33,84.71 arc-60 111.93,86.21 CON9.1
BATT_VOLTAGE  (via drill 0.35)
  Top 0.2: CON1.47 81.94,103.08 v81.54,103.48
  Bottom 0.2: v81.54,103.48 82.76,102.26 arc45 84.88,101.38 94.14,101.38 arc-90 99.64,95.88 99.64,89.49 arc60 101.14,86.9 104.68,84.85 arc90 107.41,85.59 107.92,86.48 arc-60 109.66,87.48 120.24,87.48 arc-90 121.24,86.48 121.24,85.8 arc-45 120.66,84.38 CON9.2
CAN1_H
  Top 0.2: 40.33,132.7 38.65,133.67 arc-90 37.44,138.19 41.07,144.46 arc-60 42.35,145.2 43.67,145.2 arc-45 44.38,144.91 CON22.2 44.87,144.42 48.56,144.42 arc45 49.97,145.01 53.65,148.69 arc-45 57.19,150.15 121.16,150.15 arc-90 125.11,146.2 125.11,145.93 CON27.2 124.86,145.28 arc90 128.71,141.43 131.44,141.43 arc-60 135.17,139.28 167.25,83.7 arc-75 166.37,77.03 CON26.2 165.25,76.33 arc45 163.84,72.94 163.84,71.84 arc45 164.45,70.37 164.53,70.29 arc-45 165.14,68.81 165.14,64.51 arc-30 164.63,62.6 149.54,36.95 arc-60 146.09,34.98 141.55,34.98 arc45 138.72,33.81 CON25.2 136.37,31.46 arc-45 133.53,30.28 122.38,30.28 arc-45 120.26,31.16 117.97,33.45 arc90 112.91,33.45 110.62,31.16 arc-45 108.5,30.28 91.68,30.28 arc-45 89.73,31.09 87.57,33.25 arc90 82.82,33.25 80.65,31.09 arc-45 78.7,30.28 53.09,30.28 arc90 50.84,28.03 50.84,6.38 arc-90 48.84,4.38 47.77,4.38 arc-90 46.57,5.58 46.57,6.19 arc45 46.28,6.9 CON24.2 45.47,7.71 arc-45 45.17,8.42 45.17,8.53 arc90 42.37,11.33 39.02,11.33 arc-60 36.21,12.95 5.43,66.23 arc-30 4.64,69.18 4.64,72.4 arc-45 5.22,73.81 CON23.2 7.11,75.69 arc45 7.69,77.11 7.69,79.65 arc45 7.11,81.06 6.67,81.5 arc-75 6.05,86.16 8.09,89.69 8.98,91.23 arc-60 15.04,94.73 74.87,94.73 arc45 77.55,95.84 77.61,95.9 arc-75 78.21,95.98 CON1.79 | 40.33,132.7 46.92,128.9 47.23,128.9 arc45 CON28.2 | R2.1 40.33,132.73 40.33,132.7
CAN1_L
  Top 0.2: CON26.3 166.46,75.05 arc75 167.69,84.35 135.86,139.48 arc60 131.53,141.98 128.77,141.98 arc-90 127.02,143.73 CON27.3 126.77,144.68 126.77,145 arc90 120.92,150.85 57.09,150.85 arc45 53.55,149.39 49.59,145.43 arc-90 47.28,145.43 CON22.3 46.88,145.83 42.64,145.83 arc60 40.64,144.67 37.04,138.43 arc90 38.44,133.2 38.45,133.21 38.6,133.13 | CON26.3 | 38.6,133.13 45.67,129.04 arc-60 46.37,127.84 46.37,127.24 CON28.3 | SJ2.2 38.6,133.11 38.6,133.13 | CON1.77 78.47,96.42 arc76 77.35,96.29 77.33,96.27 arc-45 74.7,95.18 55.46,95.18 arc-45 54.05,95.76 52.99,96.82 arc90 50.98,96.82 49.93,95.76 arc-45 48.51,95.18 14.97,95.18 arc60 8.47,91.43 5.47,86.23 arc75 6.14,81.18 6.56,80.76 arc-45 7.14,79.35 7.14,79.06 arc-45 6.56,77.64 CON23.3 4.6,75.69 arc45 4.01,74.27 4.01,69.71 arc30 5.14,65.51 35.73,12.63 arc60 38.85,10.83 42.06,10.83 arc-90 43.86,9.03 CON24.3 44.42,7.85 arc-45 44.71,7.14 44.71,6.73 arc90 47.56,3.88 49.24,3.88 arc90 51.34,5.98 51.34,27.83 arc-90 53.29,29.78 78.76,29.78 arc45 80.89,30.66 83.07,32.84 arc-90 87.31,32.84 89.5,30.66 arc45 91.62,29.78 108.76,29.78 arc45 110.89,30.66 113.32,33.09 arc-90 117.56,33.09 120,30.66 arc45 122.12,29.78 135.76,29.78 arc45 138.12,30.76 140.14,32.78 CON25.3 140.72,33.31 arc-45 143.55,34.48 146.22,34.48 arc60 150.1,36.7 165.13,62.26 arc30 165.64,64.17 165.64,68.77 arc45 164.86,70.66 164.85,70.67 arc-45 164.34,71.9 164.34,73.03 arc-90 165.84,74.53 CON26.3
CAN2_H
  Top 0.2: CON1.41 81.92,104.82 arc30 69.98,108.06 57.26,108.06 53.72,108.06 arc-30 51.9,108.55 50.46,109.38 arc30 48.96,109.78 48.66,109.78 arc-45 CON6.2
CAN2_L
  Top 0.2: CON1.39 81.67,105.55 arc30 70.27,108.63 53.64,108.63 arc-30 52.14,109.03 51.4,109.46 arc-60 50.07,111.76 CON6.3
CTS_2  (via drill 0.5 pad 1)
  Top 0.2: v60.14,61.28 60.75,61.88 arc45 61.04,62.59 61.04,65.06 arc45 60.75,65.77 59.84,66.68 arc90 58.45,66.68 35.31,43.54 arc45 33.84,40.01 33.84,31.99 arc90 37.14,28.69 CON29.2
  Bottom 0.2: MODULE1.14 88.64,55.48 82.72,61.4 arc45 80.6,62.28 61.83,62.28 arc45 61.34,62.07 60.75,61.48 arc-45 60.25,61.28 v60.14,61.28
CTS_3  (via drill 0.5 pad 1)
  Top 0.2: CON32.2 45.57,31.28 arc45 45.27,31.99 45.23,32.03 arc-45 44.94,32.73 44.94,46.41 arc-45 46.41,49.94 58.35,61.88 arc-45 59.06,62.18 v59.14,62.18
  Bottom 0.2: MODULE1.10 87.91,59.28 arc-45 84.38,60.74 83.12,62 arc45 81,62.88 61.66,62.88 arc45 61.17,62.67 60.88,62.38 arc-45 60.38,62.18 v59.14,62.18
CTS_4
  Top 0.2: CON5.2 93.82,41.65 arc-45 92.94,43.77 92.94,67.53 arc90 91.94,68.53 88.44,68.53 arc90 87.44,67.53 87.44,65.31 arc45 88.03,63.89 MODULE1.6
ETH1_RX+
  Top 0.2: CON21.2 63.16,33.24 arc45 63.74,34.66 63.74,45.78 arc-90 72.09,54.13 74.45,54.13 arc45 75.99,54.76 M1.J1.3
ETH1_RX-
  Top 0.2: M1.J1.6 76.03,53.09 arc45 74.49,53.73 72.14,53.73 arc90 64.14,45.73 64.14,34.66 arc45 64.73,33.24 CON21.1
ETH1_TX+
  Top 0.2: M1.J1.1 76.01,59.86 arc-45 74.47,59.23 73.09,59.23 arc90 58.74,44.88 58.74,34.66 arc-45 58.16,33.24 CON21.4
ETH1_TX-
  Top 0.2: M1.J1.2 76.01,58.19 arc45 74.47,58.83 73.14,58.83 arc90 59.14,44.83 59.14,34.66 arc45 59.73,33.24 CON21.3
ETH3_RX+
  Bottom 0.2: M1.J3.3 45.05,79.14 arc45 44.47,80.55 43.53,81.49 arc-45 42.94,82.91 42.94,85.68 arc-90 47.24,89.98 64.44,89.98 arc90 69.44,94.98 69.44,96.81 arc-45 70.91,100.34 105.15,134.58 arc45 106.02,136.7 CON13.4
ETH3_RX-
  Bottom 0.2: M1.J3.6 43.93,81.69 arc-45 43.34,83.11 43.34,85.58 arc-90 47.34,89.58 64.44,89.58 arc90 69.84,94.98 69.84,96.61 arc-45 71.31,100.14 106.27,135.11 arc-45 CON13.5
ETH3_TX+
  Bottom 0.2: M1.J3.1 40.46,78.51 arc45 41.04,79.93 41.04,86.38 arc-90 46.44,91.78 63.04,91.78 arc90 66.04,94.78 66.04,96.61 arc-45 67.51,100.14 100.86,133.5 arc45 101.74,135.62 101.74,139.6 CON13.2
ETH3_TX-
  Bottom 0.2: M1.J3.2 42.03,78.51 arc-45 41.44,79.93 41.44,86.38 arc-90 46.44,91.38 63.04,91.38 arc90 66.44,94.78 66.44,96.41 arc-45 67.91,99.94 101.26,133.3 arc45 102.14,135.42 102.14,135.43 arc-45 103.02,137.56 CON13.3
ETH5_RX+
  Top 0.2: CON35.3 19.84,46.22 19.84,48.15 arc-45 20.43,49.56 27.16,56.29 arc-45 28.57,56.88 29.39,56.88 arc-45 30.81,56.29 M1.J5.3
ETH5_RX-
  Top 0.2: CON35.4 26.89,56.69 arc-45 28.31,57.28 29.39,57.28 arc45 30.81,57.86 M1.J5.6
ETH5_TX+
  Top 0.2: M1.J5.1 30.83,51.19 arc45 29.41,51.78 27.64,51.78 arc90 22.64,46.78 22.64,42.19 CON35.1
ETH5_TX-
  Top 0.2: CON35.2 21.66,44.62 arc45 22.24,46.04 22.24,46.78 arc-90 27.74,52.28 29.47,52.28 arc45 30.89,52.86 M1.J5.2
GND  (via drill 0.5 pad 1)  (2 unrouted)
  Top 0.2: CON19.P$1 61.74,116.28 | CON19.P$2 64.54,121.08
  other vias: 83.94,108.78 76.94,112.78 80.04,115.88 82.94,118.78 90.94,117.78 82.44,122.78 85.24,121.08 11.74,90.28 9.84,80.98 25.84,106.38 85.34,92.98 89.54,94.68 92.84,92.78 102.64,116.58 102.09,108.73 100.84,93.68 122.44,35.18 79.54,119.88 71.24,118.88 72.59,115.53 16.89,54.78 13.09,73.08 5.99,69.88 23.69,92.48 30.99,90.38 45.79,100.88 39.29,104.68 37.39,119.88 38.69,135.28 44.99,131.68 46.79,134.38 40.69,137.98 49.59,142.08 55.09,135.68 67.19,133.68 75.29,135.58 78.09,139.83 94.29,140.18 94.89,135.58 100.29,134.78 87.94,123.78 85.29,125.98 109.19,127.58 112.09,125.78 105.69,113.68 119.39,144.78 121.69,142.08 141.69,114.38 143.89,110.88 127.89,101.98 136.59,106.38 134.19,110.48 117.69,95.68 112.19,93.48 32.09,83.78 34.89,83.78 13.79,80.28 48.39,72.18 34.19,72.58 37.89,64.78 34.29,59.78 53.59,64.98 61.79,68.88 72.19,85.08 80.99,79.38 83.09,84.18 86.79,78.78 73.69,66.48 83.79,69.18 83.99,63.08 74.19,60.98 61.79,60.68 60.74,55.28 69.49,34.38 91.29,40.08 99.89,40.88 101.39,71.18 104.49,75.58 108.79,75.68 114.19,75.68 101.29,75.88 127.99,40.08 129.99,48.18 148.29,99.08 163.79,85.28 151.29,81.38 42.39,46.68 38.79,34.58 51.19,34.18 31.49,35.08 48.09,65.38 25.09,72.28 27.59,59.38 21.89,59.18 120.69,110.38 120.89,113.28 122.19,111.78 100.59,110.93 92.79,98.43 102.04,87.78 98.64,96.38 106.79,83.48 117.39,84.58 99.39,86.68 98.69,91.28 95.19,96.38 95.69,90.38 95.59,75.68 105.29,55.98 105.29,64.68 117.39,68.38 109.09,42.68 121.89,32.28 109.19,32.38
  pour Bottom (rank 3): 1.33,80.78 arc60 1.33,70.78 39.3,5 arc60 47.97,0 49.09,0 arc90 52.09,3 52.09,27.88 arc-90 53.09,28.88 146.37,28.88 170.55,70.78 arc60 170.55,80.78 132.58,146.55 arc60 123.92,151.55 47.97,151.55 arc60 39.3,146.55
  pour Top (rank 3): 1.33,80.78 arc60 1.33,70.78 39.3,5 arc60 47.97,0 49.09,0 arc90 52.09,3 52.09,27.88 arc-90 53.09,28.88 146.37,28.88 170.55,70.78 arc60 170.55,80.78 132.58,146.55 arc60 123.92,151.55 47.97,151.55 arc60 39.3,146.55
I2C2_SCL
  Top 0.2: CON1.6 93.22,108.67 arc89 95.16,109.14 96.14,110.72 arc91 95.4,113.78 84.73,120.24 arc31 80.99,121.28 74.01,121.28 arc-31 72.46,121.71 71.14,122.5 D12.2 70.87,122.71 61.59,128.07 arc90 60.11,127.67 60.21,127.84 R35.2
I2C2_SDA
  Top 0.2: CON1.4 93.43,109.13 arc90 94.8,109.48 94.94,109.73 95.66,110.92 arc90 95.1,113.23 84.28,119.81 arc31 80.84,120.78 70.4,120.78 arc45 D12.1 69.74,120.76 69.74,122.15 arc60 69.19,123.1 61.41,127.59 arc90 60.49,127.35 60.28,126.98 arc-86 59.63,126.79 59.5,126.85 R36.2
M1PWM
  Top 0.2: CON27.1 122.69,145.74 93.96,98.29 arc-89 90.67,97.44 CON1.50
M2PWM
  Top 0.2: CON1.52 97.39,92.77 arc31 98.93,92.34 107.41,92.34 arc-45 110.94,90.88 111.58,90.24 arc45 115.11,88.78 152.55,88.78 arc-45 159.62,85.85 CON26.1
M3PWM
  Top 0.2: CON25.1 125.58,32.78 arc-45 118.51,35.71 100.86,53.36 arc-45 97.89,60.52 97.89,89.03 arc59 95.47,93.32 92.76,94.95 92.75,94.95 86.81,98.52 CON1.54
M4PWM
  Top 0.2: CON1.56 86.4,98.2 95.35,92.8 arc-59 97.34,89.28 97.34,56.5 arc45 98.81,52.96 105.48,46.29 arc-45 106.94,42.76 106.94,32.08 arc-90 106.14,31.28 92.18,31.28 arc-45 90.06,32.16 88.02,34.2 arc90 82.36,34.2 80.32,32.16 arc-45 78.2,31.28 51.89,31.28 arc90 48.99,28.38 48.99,6.7 CON24.1
M5PWM
  Top 0.2: CON1.58 87.09,97.2 arc-60 88.09,95.47 88.09,91.78 arc-90 85.89,89.58 81.1,89.58 arc-45 78.35,90.72 78.1,90.97 arc45 75.42,92.08 31.76,92.08 arc60 13.01,81.25 8.79,73.94 arc-60 6.58,72.66 CON23.1
M6PWM  (via drill 0.5 pad 1)
  Top 0.2: CON1.60 86.73,96.84 arc-60 87.59,95.36 87.59,91.78 arc-90 85.89,90.08 80.94,90.08 arc-45 78.72,91 78.28,91.44 arc45 75.53,92.58 57.27,92.58 arc-45 55.86,93.16 v55.44,93.58 | v55.44,98.18 54.66,98.96 arc45 52.69,99.78 52.07,99.78 arc-30 50.37,100.23 38.17,107.24 arc-90 36.33,114.07 39.72,119.96 arc-60 42.28,121.44 43.83,121.44 arc60 47.62,123.63 50.68,128.97 arc57 50.78,132.76 46.55,141.1 arc63 43.58,142.92 43.32,143.18 CON22.1
  Bottom 0.2: v55.44,93.58 v55.44,98.18
N$1
  Top 0.5: LED4.A 64.35,111.86 R18.2
N$2
  Top 0.5: CON8.1 62.61,81.02 arc45 63.49,83.14 CON4.2
N$3
  Top 0.5: Q1.3 BUZ1.2
N$4  (via drill 0.5 pad 1)
  Top 0.2: v94.04,47.88 94.02,47.9 94.02,49.18 R1.1
  Bottom 0.2: MODULE1.19 91.81,49.28 arc-45 93.23,48.69 v94.04,47.88
N$5
  Top 0.2: R16.2 R20.1 117.49,111.95 Q1.1
N$6  (via drill 0.5 pad 1)
  Top 0.2: v94.04,52.68 94.04,51.4 R3.1
  Bottom 0.2: MODULE1.17 91.81,51.28 arc45 93.23,51.86 v94.04,52.68
N$7
  Top 0.5: CON4.1 60.99,83.18 arc-45 60.11,81.06 CON8.2
N$8
  Top 0.2: R2.2 39.34,131.6 arc-87 38.25,131.3 37.74,131.58 SJ2.1
N$13
  Top 0.5: R22.P$1 113.95,128.12 113.95,128.1 115.24,127.4 arc29 117.08,126.93 118.09,126.93 BUZ1.1 118.44,126.53 arc90 120.44,124.53 126.24,124.53 R23.P$1
N$20
  Top 0.2: R35.1 58.71,128.86 59.3,129.8 arc-58 60.15,130.28 60.58,130.28 arc90 61.88,131.58 61.88,133.66 CON15.3
N$21
  Top 0.2: R36.1 58.01,127.72 arc-89 57.78,128.61 59.19,131.03 arc-60 60.05,131.53 CON15.4
N$22
  Top 0.2: CON17.3 72.23,129.69 arc60 73.53,130.44 74.86,132.74 arc-90 76.91,133.29 78.85,132.17 R37.1
N$23
  Top 0.2: CON17.4 67.8,127.8 arc-45 69.09,128.33 72.07,128.33 arc60 73.37,129.08 74.42,130.9 arc-90 76.47,131.45 77.96,130.59 R38.1
OTG_DM1  (via drill 0.5 pad 1)
  Top 0.2: CON19.A7 62.29,119.49 arc-45 61.82,120.1 60.66,124.41 CON14.4 | CON1.33 84.44,105.66 72.41,112.61 65.51,116.59 arc30 65.01,116.72 v64.77,116.72 64.6,116.82 64.47,117.31 arc45 64,117.93 63.72,118.09 63.7,118.11 CON19.B7
  Bottom 0.2: v64.77,116.72 64.73,116.87 arc45 64.27,117.48 62.66,118.41 arc-45 62.19,119.02 CON14.4
OTG_DP1  (via drill 0.5 pad 1)
  Top 0.2: CON19.B6 65.31,117.75 v65.37,117.76 arc60 65.82,116.99 81.17,108.13 81.18,108.13 84.64,106.13 CON1.31 | CON19.A6 62.35,118.87 62.32,118.9 61.92,119.12 arc-45 61.46,119.73 61.12,121 arc45 60.67,121.59 60.34,121.78 59.6,122.2 CON14.3
  Bottom 0.2: v65.37,117.76 65.23,117.72 arc-45 64.47,117.82 63,118.67 arc-45 62.53,119.28 61.59,122.82 arc-45 61.69,123.58 61.99,124.1 arc90 61.62,125.47 61.11,125.77 arc90 59.74,125.4 59.18,124.44 arc45 59.08,123.68 CON14.3
PPM-SBUS-PROT  (via drill 0.5 pad 1)
  Top 0.2: CON1.62 86.15,96.59 arc-59 86.84,95.38 86.84,92.13 arc-45 v86.59,91.53 | CON18.5 18.76,79.53 arc45 20.18,80.11 22.88,82.82 arc-45 42.1,90.78 74,90.78 arc-45 76.8,89.61 77.62,88.8 arc45 80.2,87.73 82.98,87.73 arc45 v83.94,88.13
  Bottom 0.2: v83.94,88.13 86.06,90.25 arc45 v86.59,91.53
RX_2  (via drill 0.5 pad 1)
  Top 0.2: CON29.3 36.32,40.82 arc-45 37.78,44.35 58.31,64.88 arc-45 59.02,65.18 59.9,65.18 arc-45 v60.14,65.08
  Bottom 0.2: MODULE1.13 92.18,56.81 arc45 93.64,60.35 93.64,66.88 arc90 90.64,69.88 88.48,69.88 arc45 86.36,69 82.92,65.56 arc-45 80.8,64.68 60.83,64.68 arc-45 60.34,64.88 v60.14,65.08
RX_3  (via drill 0.5 pad 1)
  Top 0.2: CON32.3 44.34,30.89 44.34,46.71 arc-45 45.81,50.24 58.45,62.88 arc-45 59.16,63.18 v60.04,63.18
  Bottom 0.2: MODULE1.9 90.98,59.61 arc45 92.44,63.15 92.44,66.68 arc90 90.44,68.68 88.88,68.68 arc45 86.76,67.8 83.32,64.36 arc-45 81.2,63.48 60.63,63.48 arc45 60.14,63.27 v60.04,63.18
RX_4
  Top 0.2: MODULE1.5 91.86,62.06 arc-45 92.44,60.65 92.44,43.52 arc45 93.32,41.4 99.31,35.41 arc-45 100.19,33.28 CON5.3
SERIAL1_RX  (via drill 0.5 pad 1)
  Top 0.2: v90.74,98.78 90.74,99.77 arc60 89.79,101.42 CON1.38 | CON18.4 23.41,82.5 arc-45 42.19,90.28 74.1,90.28 arc-45 76.25,89.39 77.03,88.6 arc45 80.35,87.23 v84.84,87.23 84.84,85.65 arc45 86.3,82.11 94.58,73.84 arc-45 96.04,70.31 96.04,50.88 arc-45 95.46,49.47 95.37,49.38 R1.2
  Bottom 0.2: v90.74,98.78 90.85,98.67 arc-45 91.14,97.96 91.14,96.47 arc-45 88.71,90.59 85.69,87.58 arc-45 v84.84,87.23
SERIAL1_TX  (via drill 0.5 pad 1)
  Top 0.2: v89.44,99.38 89.44,100.48 arc60 88.94,101.35 88.38,101.67 CON1.40 | CON18.3 18.76,75.34 arc45 19.34,76.76 19.34,76.9 arc-45 19.93,78.31 23.56,81.95 arc-45 42.58,89.83 74.01,89.83 arc-45 75.85,89.06 76.63,88.29 arc45 80.4,86.73 82.68,86.73 arc-45 v83.89,86.23 84.11,86.01 arc-45 84.34,85.45 arc45 85.81,81.91 94.1,73.62 arc-45 95.57,70.08 95.57,51.48 R3.2
  Bottom 0.2: v83.89,86.23 84.41,86.23 arc45 85.83,86.81 89.24,90.22 arc45 91.84,96.51 91.84,98.68 arc90 90.84,99.68 90.16,99.68 arc45 v89.45,99.38 v89.44,99.38
SERIAL2_RX
  Top 0.2: CON1.34 90.88,101.91 arc90 95.05,102.97 98.48,108.73 arc90 96.49,116.57 82.41,124.96 arc-59 80.94,127.54 80.94,129.17 D10.2 R38.2
SERIAL2_TX
  Top 0.2: CON1.36 90.72,101.49 arc89 95.51,102.78 98.92,108.56 arc90 96.66,116.97 83.4,124.92 arc-59 81.94,127.5 81.94,130.76 D10.1 R37.2
SERIAL3_RX  (via drill 0.5 pad 1)
  Top 0.2: v93.14,104.08 93.14,104.39 arc60 92.89,104.82 CON1.20 | v73.24,87.88 73.04,87.68 arc-45 72.56,87.48 arc45 71.85,87.18 48.71,64.04 arc-45 45.17,62.58 29.81,62.58 arc45 26.28,61.11 18.74,53.57 arc-45 16.62,52.69 CON35.6
  Bottom 0.2: v73.24,87.88 73.24,88.25 arc-45 73.83,89.66 75.36,91.2 arc45 76.24,93.32 76.24,99.78 arc-90 81.44,104.98 92.24,104.98 arc-90 v93.14,104.08
SERIAL3_TX  (via drill 0.5 pad 1)
  Top 0.2: v91.94,104.08 91.94,104.51 arc59 91.7,104.94 90.63,105.57 CON1.22 | CON35.5 arc-45 17.97,52.1 26.48,60.61 arc-45 30.01,62.08 45.27,62.08 arc45 48.98,63.61 72.05,86.68 arc-45 72.76,86.98 73.64,86.98 arc90 v74.54,87.88
  Bottom 0.2: v91.94,104.08 arc45 90.73,104.58 81.44,104.58 arc90 76.74,99.88 76.74,93.12 arc-45 75.86,91 75.03,90.16 arc45 74.54,88.99 v74.54,87.88
SERIAL4_RX  (via drill 0.5 pad 1)
  Top 0.2: v94.29,105.88 93.4,105.88 arc-29 92.92,106 91.38,106.85 CON1.16
  Bottom 0.2: v94.29,105.88 94.99,105.88 104.96,95.91 arc-45 105.84,93.78 105.84,92.65 arc45 CON11.4
SERIAL4_TX  (via drill 0.5 pad 1)
  Top 0.2: v94.94,104.58 94.61,104.58 arc-30 94.11,104.71 91.28,106.33 CON1.18
  Bottom 0.2: CON11.3 105.27,93.46 arc45 104.39,95.58 95.39,104.58 v94.94,104.58
SERIAL5_RX  (via drill 0.5 pad 1)
  Top 0.2: CON1.12 92.23,107.51 arc30 92.73,107.38 96.18,107.38 arc45 v96.54,107.53
  Bottom 0.2: CON30.4 113.88,104.55 arc45 111.76,105.43 99.88,105.43 arc-45 97.76,106.31 v96.54,107.53
SERIAL5_TX  (via drill 0.5 pad 1)
  Top 0.2: v96.04,106.28 95.83,106.48 arc45 95.13,106.78 92.8,106.78 arc-30 92.27,106.92 92.12,107.01 CON1.14
  Bottom 0.2: CON30.3 112.42,102.6 arc45 110.29,103.48 100.08,103.48 arc-45 97.96,104.36 v96.04,106.28
TX_2  (via drill 0.5 pad 1)
  Top 0.2: v59.14,66.08 arc45 58.46,65.79 36.53,43.87 arc45 35.07,40.33 CON29.4
  Bottom 0.2: MODULE1.15 92.78,55.41 arc45 94.24,58.95 94.24,66.98 arc90 90.74,70.48 88.32,70.48 arc45 86.2,69.6 82.75,66.16 arc-45 80.63,65.28 62.13,65.28 arc-45 61.64,65.48 61.25,65.87 arc45 60.75,66.08 v59.14,66.08
TX_3  (via drill 0.5 pad 1)
  Top 0.2: v59.14,64.28 45.21,50.34 arc45 43.74,46.81 43.74,34.75 arc-45 43.07,33.13 CON32.4
  Bottom 0.2: MODULE1.11 91.58,58.21 arc45 93.04,61.75 93.04,66.78 arc90 90.54,69.28 88.68,69.28 arc45 86.56,68.4 83.12,64.96 arc-45 81,64.08 59.62,64.08 arc-45 v59.14,64.28
TX_4
  Top 0.2: MODULE1.7 91.36,60.56 arc-45 91.94,59.15 91.94,43.45 arc45 92.93,41.08 96.92,37.08 arc-45 97.69,35.22 CON5.4
VBUS  (via drill 0.5 pad 1)
  Top 0.2: CON1.29 67.97,116.34 arc-31 66.52,117.82 v65.97,118.8 | CON19.A4 61.81,118 61.73,118.08
  Top 0.3: 61.73,118.08 58.21,120.11 CON14.2 | CON19.B4 65.63,118.71 v65.97,118.8
  Top 0.5: D1.A 54.93,115.57 arc-91 54.38,117.65 55.67,119.81 arc-87 57.65,120.38 CON14.2
  Bottom 0.5: v65.97,118.8 arc-45 66.31,118.36 66.48,117.72 arc-90 65.33,115.73 arc-45 64.26,115.87 58.41,119.24 CON14.2
VDD_4V
  Bottom 1.5: MODULE1.21 MODULE1.23 94.44,45.28 arc90 97.44,48.28 97.44,52.53 arc-45 98.32,54.66 110.32,66.66 arc-90 115.72,66.66 arc45 117.57,65.89 CON9.9 CON9.10
VDD_5V
  Top 0.5: R23.P$2 126.44,111.97 arc-45 124.98,108.43 CON7.6
  Bottom 1: 35.95,138.59 19.43,109.97 19.7,109.8 19.44,109.97 2.54,80.7 arc60 2.54,71.48 4.66,67.81 5.05,67.13 5.13,66.99 | 148.48,116.21 131.37,145.85 arc60 123.92,150.15 47.25,150.15 arc60 40.32,146.15 35.95,138.59 | 5.13,66.99 23.39,35.36 27.42,28.38 40.52,5.7 arc60 47.96,1.4 49.09,1.4 arc90 50.69,3 50.69,27.88 arc-90 53.09,30.28 78.19,30.28 arc45 80.32,31.16 82.36,33.21 arc-90 88.02,33.21 90.06,31.16 arc45 92.18,30.28 108.7,30.28 arc45 110.82,31.16 112.62,32.96 arc-90 118.27,32.96 120.07,31.16 arc45 122.19,30.28 141.28,30.28 arc60 148.21,34.28 159.82,54.39 169.26,70.75 arc60 169.26,80.42 164.59,88.5 164.59,88.53 158.7,98.59 158.6,98.69 148.48,116.21 | CON18.2 16.46,72.03 arc31 11.35,70.63 5.13,66.99 | 35.95,138.59 CON28.1 56.33,127.33 | 56.33,127.33 46.32,110.59 arc90 47,107.85 CON6.1 | CON17.2 67.88,131.86 arc45 64.34,130.4 62.74,128.79 arc-45 59.2,127.33 56.33,127.33 | 147.94,115.9 148.48,116.21
  Bottom 1.5: 147.94,115.9 127.41,104.07 arc-30 124.91,103.4 CON7.6 CON7.5 CON7.4 113.27,98.32 | CON11.2 104.3,86.56 arc85 106.88,87.37 113.2,98.32 113.27,98.32 | CON30.2 113.27,98.33 113.27,98.32
VDD_12V
  Top 0.5: CON13.1 99.53,137.75 arc60 100.64,135.83 110.86,129.93 R22.P$2
  Top 1.5: CON2.2 CON2.3 43.99,116.59 arc60 48.32,119.09 56.57,133.36 arc-60 60.9,135.86 CON15.2
  Bottom 1.5: CON20.1 CON20.2 CON20.3 42.27,98.51 42.24,98.48 | CON15.2 67.06,135.86 arc45 69.18,136.74 69.52,137.08 arc-45 71.65,137.96 93.83,137.96 arc45 98.2,139.77 99.33,140.9 CON13.1 | 42.24,98.48 42.24,110.31 arc45 40.78,113.84 CON2.2 CON2.3 | 42.24,98.48 38.51,94.74 arc45 37.04,91.21 37.04,78.18 arc90 47.74,67.48 56.31,67.48 | M1.SUP 66.67,77.94 56.31,67.58 56.31,67.48 | CON5.1 105.19,33.98 arc90 102.19,36.98 75.31,36.98 arc-90 56.31,55.98 56.31,67.48
VDD_24V
  Top 1.5: CON8.5 CON8.4 CON8.3 51.58,75.07 arc-45 50.88,74.78 26.19,74.78 arc90 21.84,70.43 21.84,66.54 arc-60 17.72,59.41 13.83,57.16 CON35.8 | CON35.9 CON35.8 | CON35.7 CON35.8

### Text on the board
tPlace: GND | PWM | CAN_L | CAN_H | CAN_H | CAN_L | PWM | GND | GND | 12V | 12V | ETH_TX+ | SCL | ETH_TX- | ETH_RX+ | SDA | ETH_RX- | GND | GND | 5V | 5V | TX | CAN_H | + | RX | CAN_L | CAN1 TERMINATION | GND | GND | 12V | 12V | GND | Connect et non queri | GND | CAN_L | CAN_H | 5V | RX | TX | 5V | GND | Pegas V3 / Logic PCB / December 2022 | GND | GND | SBUS | 5V | CAN_L | RX | CAN_H | CAN_H | TX | CAN_L | PWM | 5V | GND | GND | GND | GND | GND | 24V | 24V | 24V | SER_RX | SER_TX | ETH_RX- | ETH_RX+ | ETH_TX- | ETH_TX+ | 5V | CAN_H | CAN_L | GND | TX+ | TX- | RX+ | RX- | GND | GND | TX_4 | RX_4 | CTS_4 | 12V | TX | RX | TX | CTS | RX | GND | CTS | GND | GND | CAN_L | CAN_H | PWM